# Altium schematic sheet sbc.SchDoc: BeagleBone Black connectors
size A4; Date: 2023-02-11; DocumentNumber: 6; SheetNumber: 2; SheetTotal: 6
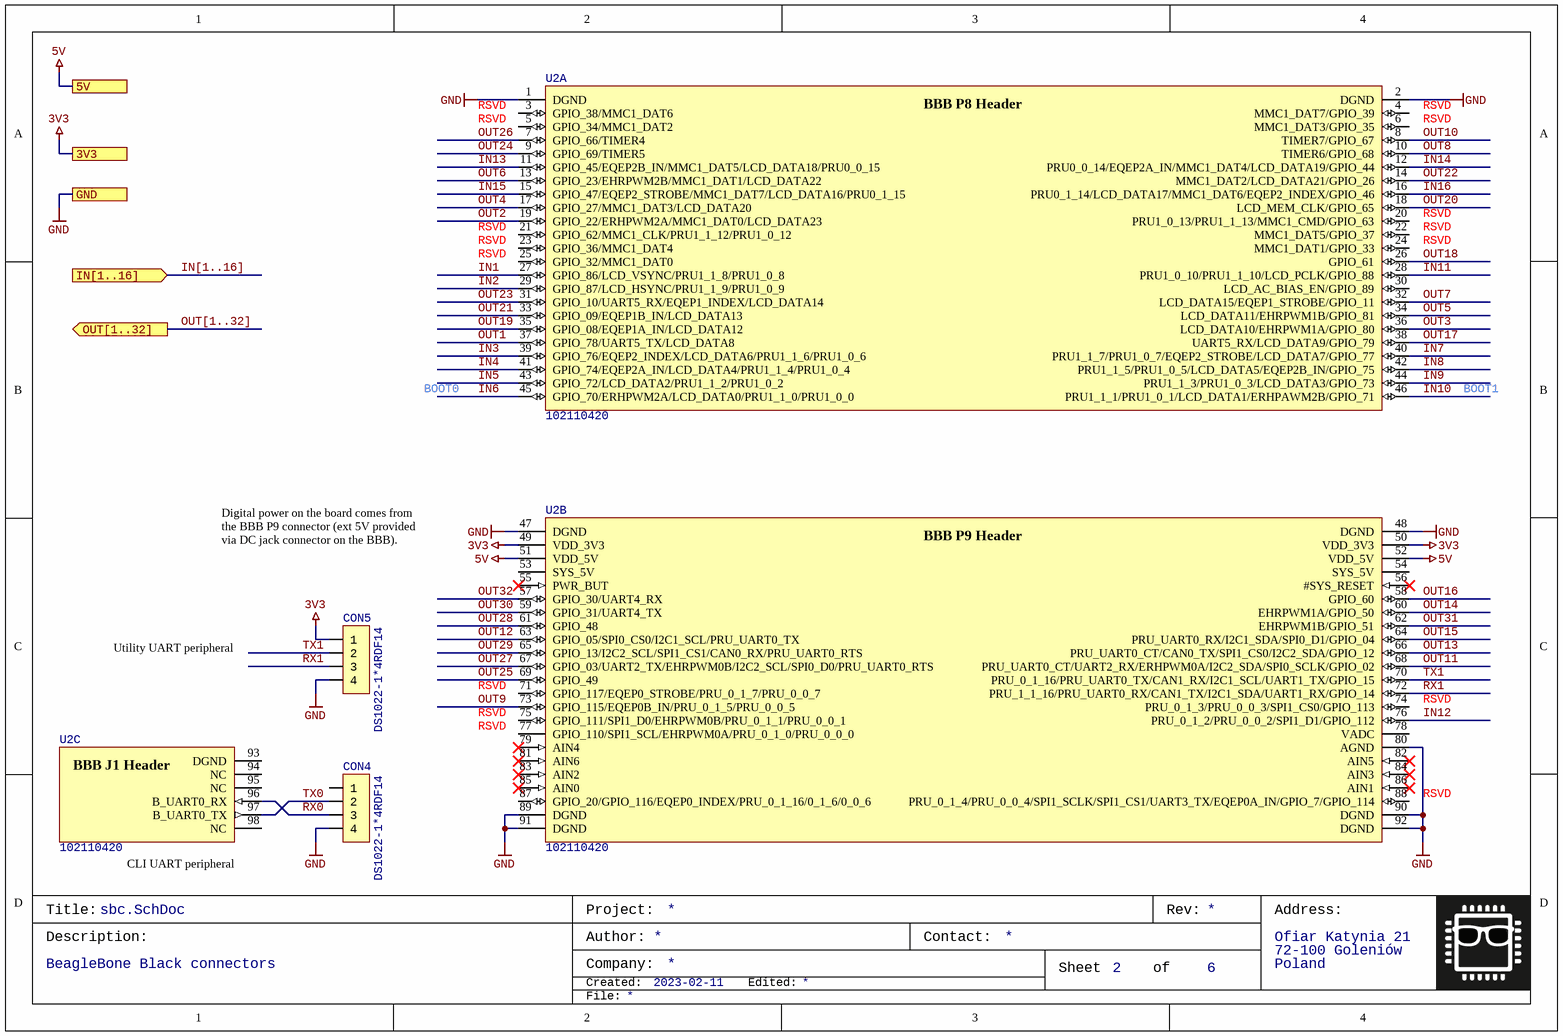
[diagram p0: sbc.SchDoc]

## Parts
CON4  DS1022-1*4RDF14  [HMTA_1X4_2.54_3.60]
CON5  DS1022-1*4RDF14  [HMTA_1X4_2.54_3.60]
U2  102110420  [BeagleBone Black No Bat]  (parts A,B,C of 3)

## Ports
3V3, 5V, GND, IN[1..16] (in), OUT[1..32] (out)

## Nets
3V3: CON5.1 U2.49(VDD_3V3) U2.50(VDD_3V3) ; port 3V3
5V: U2.51(VDD_5V) U2.52(VDD_5V) ; port 5V
GND: CON4.4 CON5.4 U2.1(DGND) U2.2(DGND) U2.47(DGND) U2.48(DGND) U2.80(AGND) U2.89(DGND) U2.90(DGND) U2.91(DGND) U2.92(DGND) ; port GND
IN1: U2.27(GPIO_86/LCD_VSYNC/PRU1_1_8/PRU1_0_8)
IN2: U2.29(GPIO_87/LCD_HSYNC/PRU1_1_9/PRU1_0_9)
IN3: U2.39(GPIO_76/EQEP2_INDEX/LCD_DATA6/PRU1_1_6/PRU1_0_6)
IN4: U2.41(GPIO_74/EQEP2A_IN/LCD_DATA4/PRU1_1_4/PRU1_0_4)
IN5: U2.43(GPIO_72/LCD_DATA2/PRU1_1_2/PRU1_0_2)
IN6: U2.45(GPIO_70/ERHPWM2A/LCD_DATA0/PRU1_1_0/PRU1_0_0)
IN7: U2.40(PRU1_1_7/PRU1_0_7/EQEP2_STROBE/LCD_DATA7/GPIO_77)
IN8: U2.42(PRU1_1_5/PRU1_0_5/LCD_DATA5/EQEP2B_IN/GPIO_75)
IN9: U2.44(PRU1_1_3/PRU1_0_3/LCD_DATA3/GPIO_73)
IN10: U2.46(PRU1_1_1/PRU1_0_1/LCD_DATA1/ERHPAWM2B/GPIO_71)
IN11: U2.28(PRU1_0_10/PRU1_1_10/LCD_PCLK/GPIO_88)
IN12: U2.76(PRU_0_1_2/PRU_0_0_2/SPI1_D1/GPIO_112)
IN13: U2.11(GPIO_45/EQEP2B_IN/MMC1_DAT5/LCD_DATA18/PRU0_0_15)
IN14: U2.12(PRU0_0_14/EQEP2A_IN/MMC1_DAT4/LCD_DATA19/GPIO_44)
IN15: U2.15(GPIO_47/EQEP2_STROBE/MMC1_DAT7/LCD_DATA16/PRU0_1_15)
IN16: U2.16(PRU0_1_14/LCD_DATA17/MMC1_DAT6/EQEP2_INDEX/GPIO_46)
OUT1: U2.37(GPIO_78/UART5_TX/LCD_DATA8)
OUT2: U2.19(GPIO_22/ERHPWM2A/MMC1_DAT0/LCD_DATA23)
OUT3: U2.36(LCD_DATA10/EHRPWM1A/GPIO_80)
OUT4: U2.17(GPIO_27/MMC1_DAT3/LCD_DATA20)
OUT5: U2.34(LCD_DATA11/EHRPWM1B/GPIO_81)
OUT6: U2.13(GPIO_23/EHRPWM2B/MMC1_DAT1/LCD_DATA22)
OUT7: U2.32(LCD_DATA15/EQEP1_STROBE/GPIO_11)
OUT8: U2.10(TIMER6/GPIO_68)
OUT9: U2.73(GPIO_115/EQEP0B_IN/PRU_0_1_5/PRU_0_0_5)
OUT10: U2.8(TIMER7/GPIO_67)
OUT11: U2.68(PRU_UART0_CT/UART2_RX/ERHPWM0A/I2C2_SDA/SPI0_SCLK/GPIO_02)
OUT12: U2.63(GPIO_05/SPI0_CS0/I2C1_SCL/PRU_UART0_TX)
OUT13: U2.66(PRU_UART0_CT/CAN0_TX/SPI1_CS0/I2C2_SDA/GPIO_12)
OUT14: U2.60(EHRPWM1A/GPIO_50)
OUT15: U2.64(PRU_UART0_RX/I2C1_SDA/SPI0_D1/GPIO_04)
OUT16: U2.58(GPIO_60)
OUT17: U2.38(UART5_RX/LCD_DATA9/GPIO_79)
OUT18: U2.26(GPIO_61)
OUT19: U2.35(GPIO_08/EQEP1A_IN/LCD_DATA12)
OUT20: U2.18(LCD_MEM_CLK/GPIO_65)
OUT21: U2.33(GPIO_09/EQEP1B_IN/LCD_DATA13)
OUT22: U2.14(MMC1_DAT2/LCD_DATA21/GPIO_26)
OUT23: U2.31(GPIO_10/UART5_RX/EQEP1_INDEX/LCD_DATA14)
OUT24: U2.9(GPIO_69/TIMER5)
OUT25: U2.69(GPIO_49)
OUT26: U2.7(GPIO_66/TIMER4)
OUT27: U2.67(GPIO_03/UART2_TX/EHRPWM0B/I2C2_SCL/SPI0_D0/PRU_UART0_RTS)
OUT28: U2.61(GPIO_48)
OUT29: U2.65(GPIO_13/I2C2_SCL/SPI1_CS1/CAN0_RX/PRU_UART0_RTS)
OUT30: U2.59(GPIO_31/UART4_TX)
OUT31: U2.62(EHRPWM1B/GPIO_51)
OUT32: U2.57(GPIO_30/UART4_RX)
RX0: CON4.3 U2.96(B_UART0_RX)
RX1: CON5.3 U2.72(PRU_1_1_16/PRU_UART0_RX/CAN1_TX/I2C1_SDA/UART1_RX/GPIO_14)
TX0: CON4.2 U2.97(B_UART0_TX)
TX1: CON5.2 U2.70(PRU_0_1_16/PRU_UART0_TX/CAN1_RX/I2C1_SCL/UART1_TX/GPIO_15)

Not connected (* = marked no-connect by the designer): CON4 1; U2 3(GPIO_38/MMC1_DAT6) 4(MMC1_DAT7/GPIO_39) 5(GPIO_34/MMC1_DAT2) 6(MMC1_DAT3/GPIO_35) 20(PRU1_0_13/PRU1_1_13/MMC1_CMD/GPIO_63) 21(GPIO_62/MMC1_CLK/PRU1_1_12/PRU1_0_12) 22(MMC1_DAT5/GPIO_37) 23(GPIO_36/MMC1_DAT4) 24(MMC1_DAT1/GPIO_33) 25(GPIO_32/MMC1_DAT0) 30(LCD_AC_BIAS_EN/GPIO_89) 53(SYS_5V) 54(SYS_5V) 55(PWR_BUT)* 56(#SYS_RESET)* 71(GPIO_117/EQEP0_STROBE/PRU_0_1_7/PRU_0_0_7) 74(PRU_0_1_3/PRU_0_0_3/SPI1_CS0/GPIO_113) 75(GPIO_111/SPI1_D0/EHRPWM0B/PRU_0_1_1/PRU_0_0_1) 77(GPIO_110/SPI1_SCL/EHRPWM0A/PRU_0_1_0/PRU_0_0_0) 78(VADC) 79(AIN4)* 81(AIN6)* 82(AIN5)* 83(AIN2)* 84(AIN3)* 85(AIN0)* 86(AIN1)* 87(GPIO_20/GPIO_116/EQEP0_INDEX/PRU_0_1_16/0_1_6/0_0_6) 88(PRU_0_1_4/PRU_0_0_4/SPI1_SCLK/SPI1_CS1/UART3_TX/EQEP0A_IN/GPIO_7/GPIO_114) 93(DGND) 94(NC) 95(NC) 98(NC)

## Buses and harness runs
bus IN[1..16] = port IN[1..16]
bus OUT[1..32] = port OUT[1..32]

## Notes on the sheet
- (near U2) RSVD
- BOOT0
- BOOT1
- Digital power on the board comes from the BBB P9 connector (ext 5V provided via DC jack connector on the BBB).
- Utility UART peripheral
- (near U2) CLI UART peripheral
- Title:
- Project:
- Rev:
- Address:
- Description:
- Created:
- Author:
- Company:
- Edited:
- Contact:
- Sheet
- of
- Ofiar Katynia 21
- 72-100 Goleniów
- Poland
- File:
- (in symbol Beaglebone Black No Bat, part A) BBB P8 Header
- (in symbol Beaglebone Black No Bat, part B) BBB P9 Header
- (in symbol Beaglebone Black No Bat, part C) BBB J1 Header

## Library data of the parts
CON4 CON5 = HMTA_1X4_2.54_3.60: Pin header; pin strips; C-Grid III; male; PIN: 4; angled 90°; THT; Manufacturer: CONNFLY; Nominal Current: 1A; Identifier: DS1022-1*4RDF14
U2 = Beaglebone Black No Bat: BeagleBone Black female headers without the battery 4 pin header; Manufacturer: BeagleBoard; Identifier: 102110420